# Altium schematic sheet Schematics.SchDoc
size A
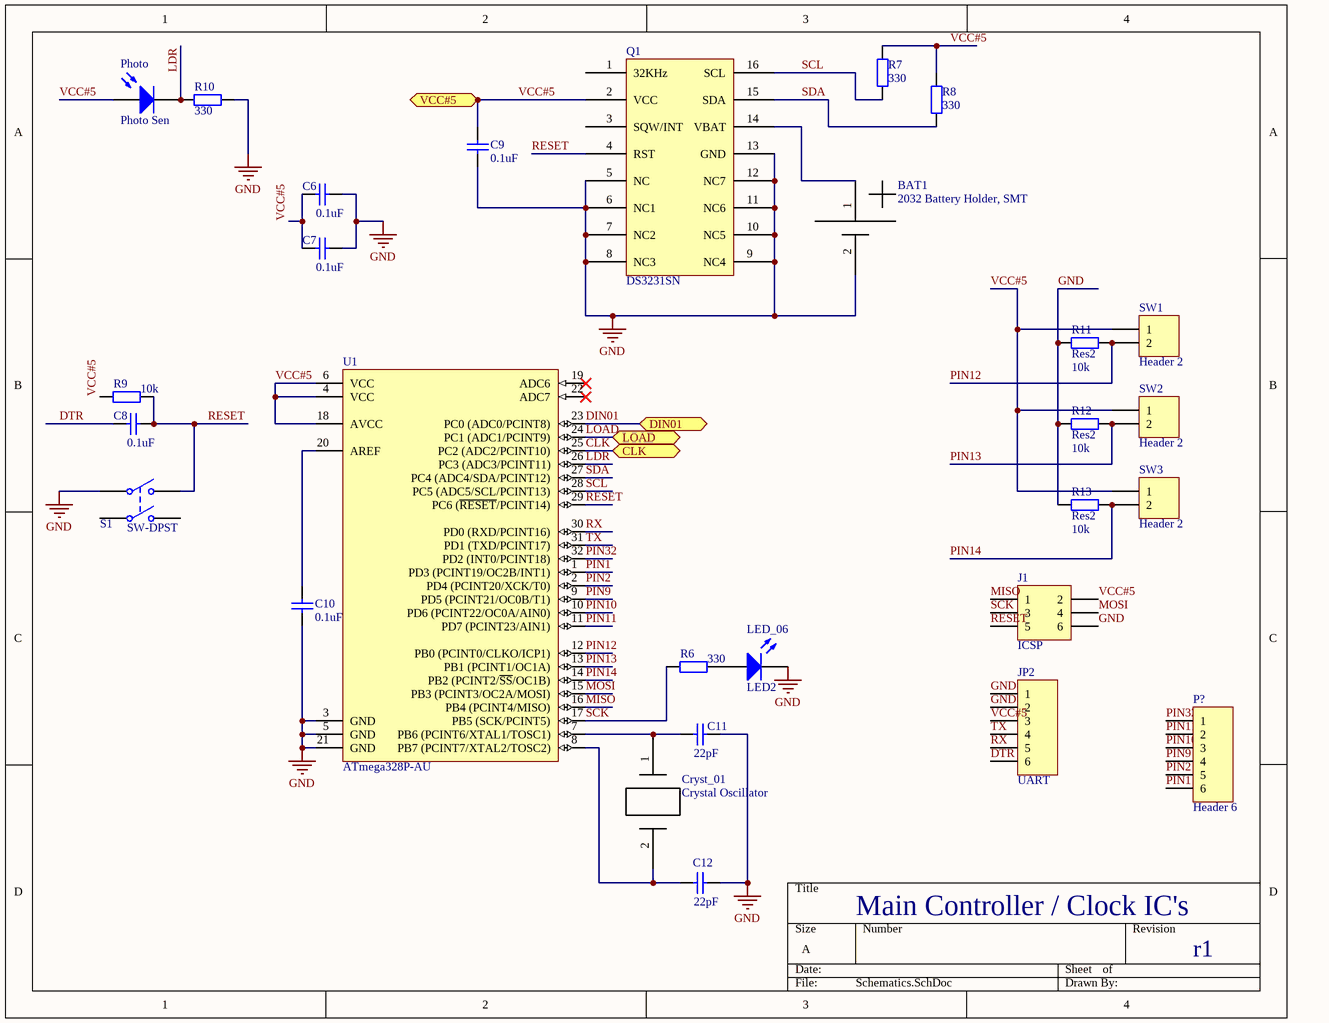
[diagram p0: Schematics.SchDoc]

## Parts
BAT1  2032 Battery Holder, SMT  [C2032 Battery Holder]
C6  value 0.1uF  [6-0805_N]  (hidden comment: Cap Semi)
C7  value 0.1uF  [6-0805_N]  (hidden comment: Cap Semi)
C8  value 0.1uF  [6-0805_N]  (hidden comment: Cap Semi)
C9  value 0.1uF  [6-0805_N]  (hidden comment: Cap Semi)
C10  value 0.1uF  [6-0805_N]  (hidden comment: Cap Semi)
C11  value 22pF  [6-0805_N]  (hidden comment: Cap Semi)
C12  value 22pF  [6-0805_N]  (hidden comment: Cap Semi)
Cryst_01  Crystal Oscillator  [Crystal Oscillator]
J1  ICSP  [HDR2X3]
JP2  UART  [HDR1X6]
LED_06  LED2  [3.2X1.6X1.1]
P?  Header 6  [HDR1X6]
Photo  Photo Sen  [PIN2]
Q1  DS3231SN  [W16-H2_N]
R6  value 330  [J1-0603]  (hidden comment: Res2)
R7  value 330  [J1-0603]  (hidden comment: Res2)
R8  value 330  [J1-0603]  (hidden comment: Res2)
R9  value 10k  [J1-0603]  (hidden comment: Res2)
R10  value 330  [J1-0603]  (hidden comment: Res2)
R11  Res2  value 10k  [J1-0603]
R12  Res2  value 10k  [J1-0603]
R13  Res2  value 10k  [J1-0603]
S1  SW-DPST  [DPST-4]
SW1  Header 2  [RightAngle Tactile Switch]
SW2  Header 2  [RightAngle Tactile Switch]
SW3  Header 2  [RightAngle Tactile Switch]
U1  ATmega328P-AU  [32A_N]

## Ports
CLK (bidir), DIN01 (bidir), LOAD (bidir), VCC#5

## Nets
GND: BAT1.2 C6.2 C7.2 C9.1 C10.1 C11.2 C12.2 J1.6 JP2.1 JP2.2 LED_06.2(K) Q1.5(NC) Q1.6(NC1) Q1.7(NC2) Q1.8(NC3) Q1.9(NC4) Q1.10(NC5) Q1.11(NC6) Q1.12(NC7) Q1.13(GND) R10.1 R11.1 R12.1 R13.1 S1.1(COMMON1) U1.3(GND) U1.5(GND) U1.21(GND)
CLK: U1.25(PC2_(ADC2/PCINT10)) ; port CLK
DIN01: U1.23(PC0_(ADC0/PCINT8)) ; port DIN01
DTR: C8.1 JP2.6
LDR: Photo.2(K) R10.2 U1.26(PC3_(ADC3/PCINT11))
LOAD: U1.24(PC1_(ADC1/PCINT9)) ; port LOAD
MISO: J1.1 U1.16(PB4_(PCINT4/MISO))
MOSI: J1.4 U1.15(PB3_(PCINT3/OC2A/MOSI))
PIN1: P?.6 U1.1(PD3_(PCINT19/OC2B/INT1))
PIN2: P?.5 U1.2(PD4_(PCINT20/XCK/T0))
PIN9: P?.4 U1.9(PD5_(PCINT21/OC0B/T1))
PIN10: P?.3 U1.10(PD6_(PCINT22/OC0A/AIN0))
PIN11: P?.2 U1.11(PD7_(PCINT23/AIN1))
PIN12: R11.2 SW1.2 U1.12(PB0_(PCINT0/CLKO/ICP1))
PIN13: R12.2 SW2.2 U1.13(PB1_(PCINT1/OC1A))
PIN14: R13.2 SW3.2 U1.14(PB2_(PCINT2/~{SS}/OC1B))
PIN32: P?.1 U1.32(PD2_(INT0/PCINT18))
RESET: C8.2 J1.5 Q1.4(RST) R9.2 S1.2(NO1) U1.29(PC6_(~{RESET}/PCINT14))
RX: JP2.5 U1.30(PD0_(RXD/PCINT16))
SCK: J1.3 R6.1 U1.17(PB5_(SCK/PCINT5))
SCL: Q1.16(SCL) R7.2 U1.28(PC5_(ADC5/SCL/PCINT13))
SDA: Q1.15(SDA) R8.1 U1.27(PC4_(ADC4/SDA/PCINT12))
TX: JP2.4 U1.31(PD1_(TXD/PCINT17))
VCC#5: C6.1 C7.1 C9.2 J1.2 JP2.3 Photo.1(A) Q1.2(VCC) R7.1 R8.2 R9.1 SW1.1 SW2.1 SW3.1 U1.4(VCC) U1.6(VCC) U1.18(AVCC) ; port VCC#5
NetBAT1_1: BAT1.1 Q1.14(VBAT)
NetC10_2: C10.2 U1.20(AREF)
NetC11_1: C11.1 Cryst_01.1 U1.7(PB6_(PCINT6/XTAL1/TOSC1))
NetC12_1: C12.1 Cryst_01.2 U1.8(PB7_(PCINT7/XTAL2/TOSC2))
NetLED_06_1: LED_06.1(A) R6.2

Not connected (* = marked no-connect by the designer): Q1 1(32KHz) 3(SQW/INT); S1 3(COMMON2) 4(NO2); U1 19(ADC6)* 22(ADC7)*

## Notes on the sheet
- Main Controller / Clock IC's
- r1

## Library data of the parts
C6-C12 = Cap Semi: Capacitor (Semiconductor SIM Model); Published: 8-Jun-2000; LatestRevisionDate: 29-May-2009; LatestRevisionNote: IPC-7351 Footprint Added.; PackageReference: C1206; Publisher: Altium Limited; PackageDescription: Chip Capacitor
J1 = Header 3X2: Header, 3-Pin, Dual row; LatestRevisionDate: 17-Jul-2002; LatestRevisionNote: Re-released for DXP Platform.; Publisher: Altium Limited
JP2 P? = Header 6: Header, 6-Pin; LatestRevisionDate: 17-Jul-2002; LatestRevisionNote: Re-released for DXP Platform.; Publisher: Altium Limited
LED_06 = LED2: Typical RED, GREEN, YELLOW, AMBER GaAs LED; Published: 8-Jun-2000; LatestRevisionDate: 17-Jul-2002; LatestRevisionNote: Re-released for DXP Platform.; PackageVersion: Feb-2002; PackageReference: 3.2X1.6X1.1; Publisher: Altium Limited; PackageDescription: SM LED; 2 Flat Leads
Photo = Photo Sen: Photosensitive Diode; Published: 24-Mar-1999; LatestRevisionDate: 17-Jul-2002; LatestRevisionNote: Re-released for DXP Platform.; PackageReference: PIN2; Publisher: Altium Limited
R6-R13 = Res2: Resistor; Published: 8-Jun-2000; LatestRevisionDate: 17-Jul-2002; LatestRevisionNote: Re-released for DXP Platform.; PackageReference: AXIAL-0.4; Publisher: Altium Limited; PackageDescription: Axial Device, Thru-Hole; 2 Leads; 0.4 in Pin Spacing
S1 = SW-DPST: Double-Pole, Single-Throw Switch; Published: 24-Mar-1999; LatestRevisionDate: 17-Jul-2002; LatestRevisionNote: Re-released for DXP Platform.; PackageReference: DPST-4; Publisher: Altium Limited; PackageDescription: Switch; 4 Leads
SW1-SW3 = Header 2: Header, 2-Pin; LatestRevisionDate: 17-Jul-2002; LatestRevisionNote: Re-released for DXP Platform.; Publisher: Altium Limited
U1 = ATmega328P-AU: 8-bit AVR Microcontroller, 32KB Flash, 1KB EEPROM, 2KB SRAM, 32-pin TQFP, Industrial Grade (-40°C to 85°C); DatasheetVersion: revD, May-2011; PackageVersion: revC, Oct-2010; PackageReference: 32A; PackageDescription: 32-Lead, 7x7x1.0 mm Body, 0.8mm Lead Pitch, Thin Profile Plastic Quad Flat Package (TQFP); Code_JEDEC: MS-026-ABA; ComponentLink1Description: Manufacturer URL; ComponentLink1URL: http://www.atmel.com/; ComponentLink2Description: ATmega48A/48PA/88A/88PA/168A/168PA/328/328P Datasheet; ComponentLink2URL: http://www.atmel.com/dyn/resources/prod_documents/doc8271.pdf; ComponentLink3Description: ATmega48A/48PA/88A/88PA/168A/168PA/328/328P Summary; ComponentLink3URL: http://www.atmel.com/dyn/resources/prod_documents/8271S.pdf